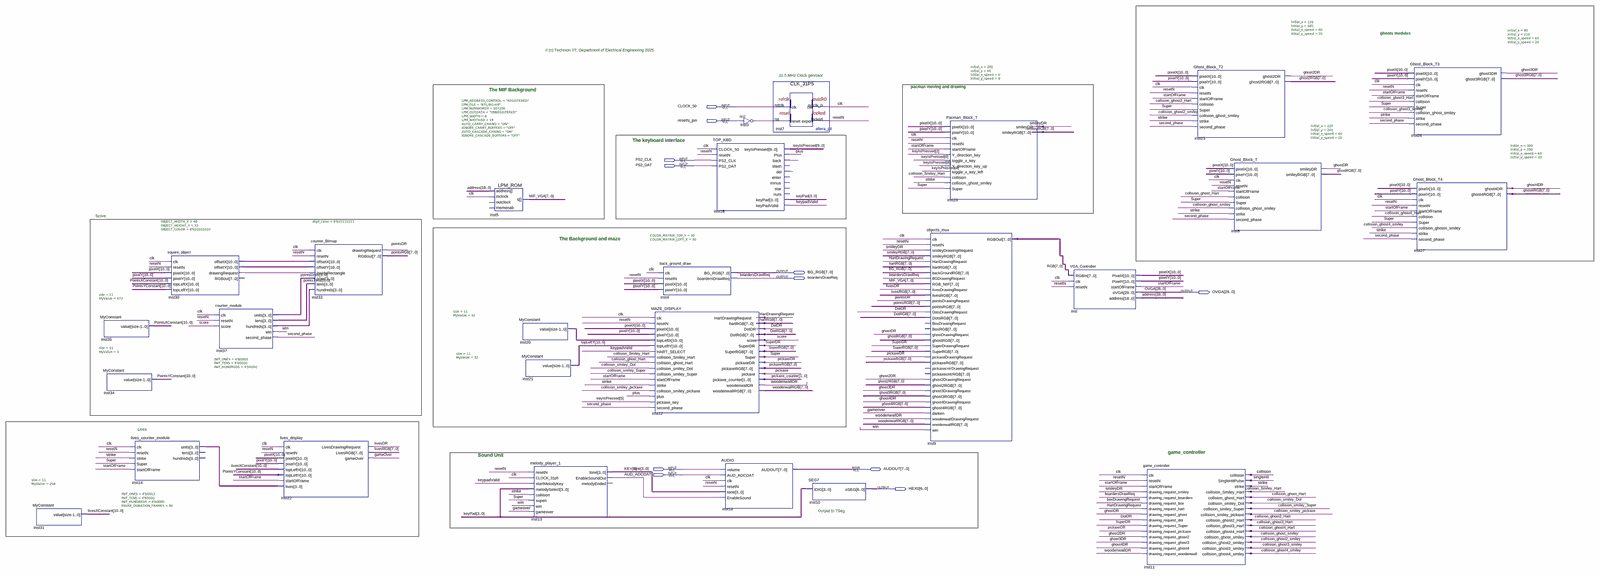
[diagram p0: schematic sheet, whole]
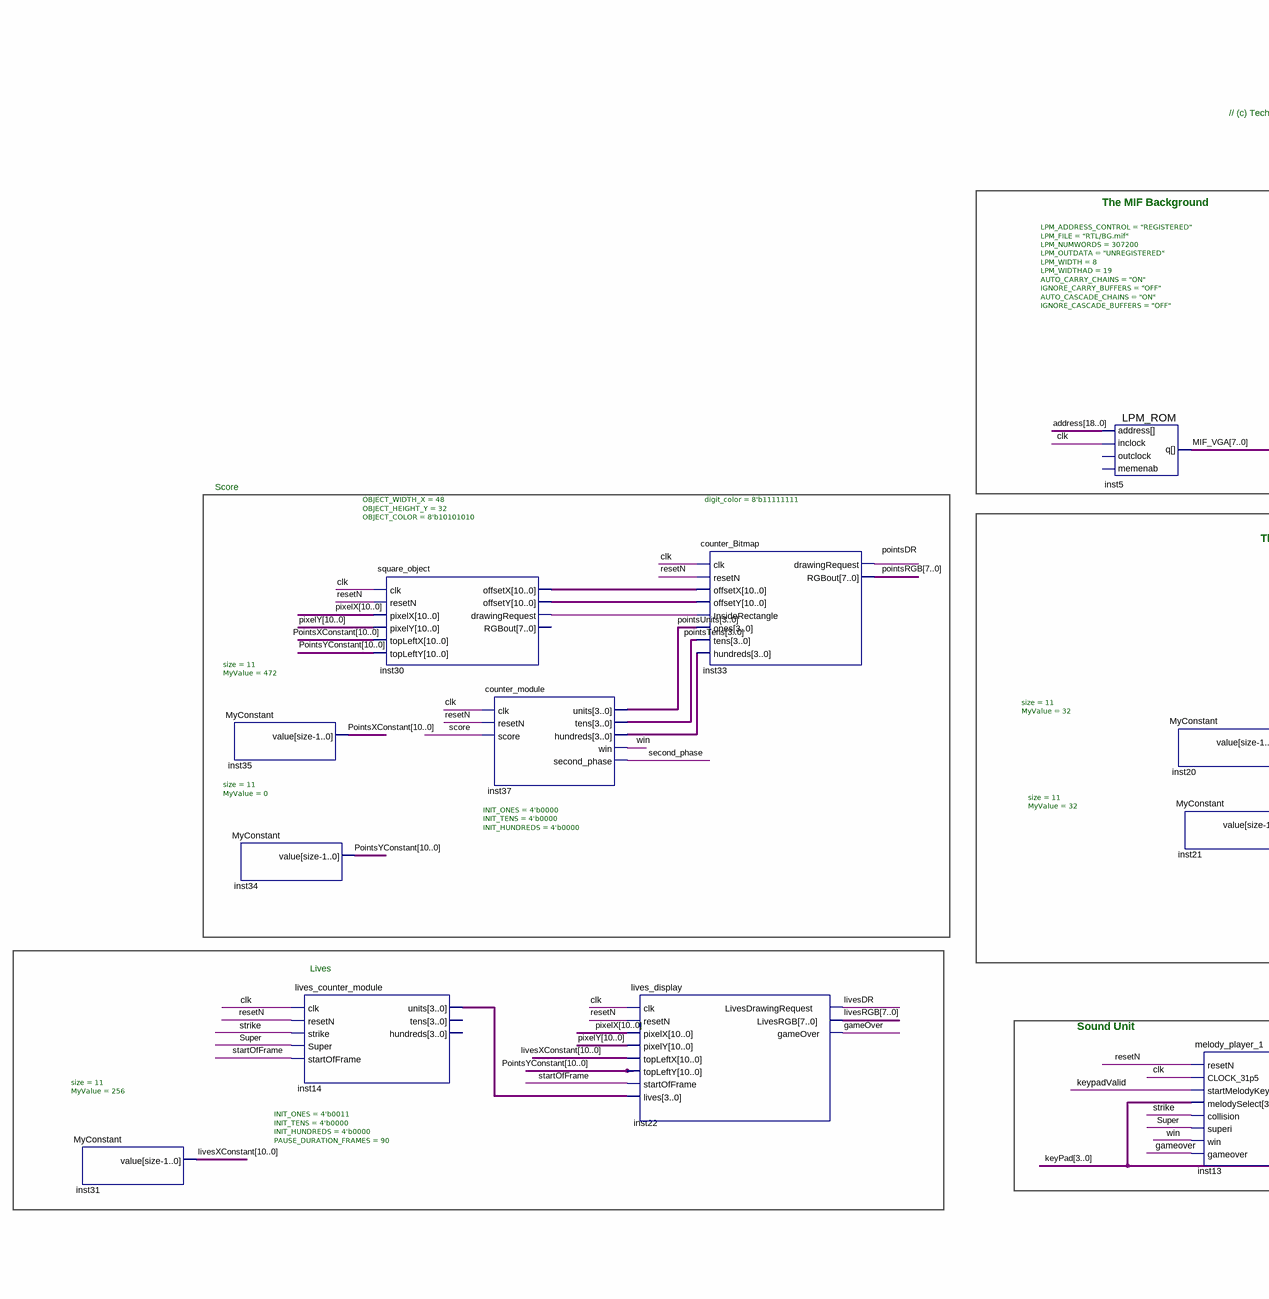
[diagram p1: schematic sheet, left part]
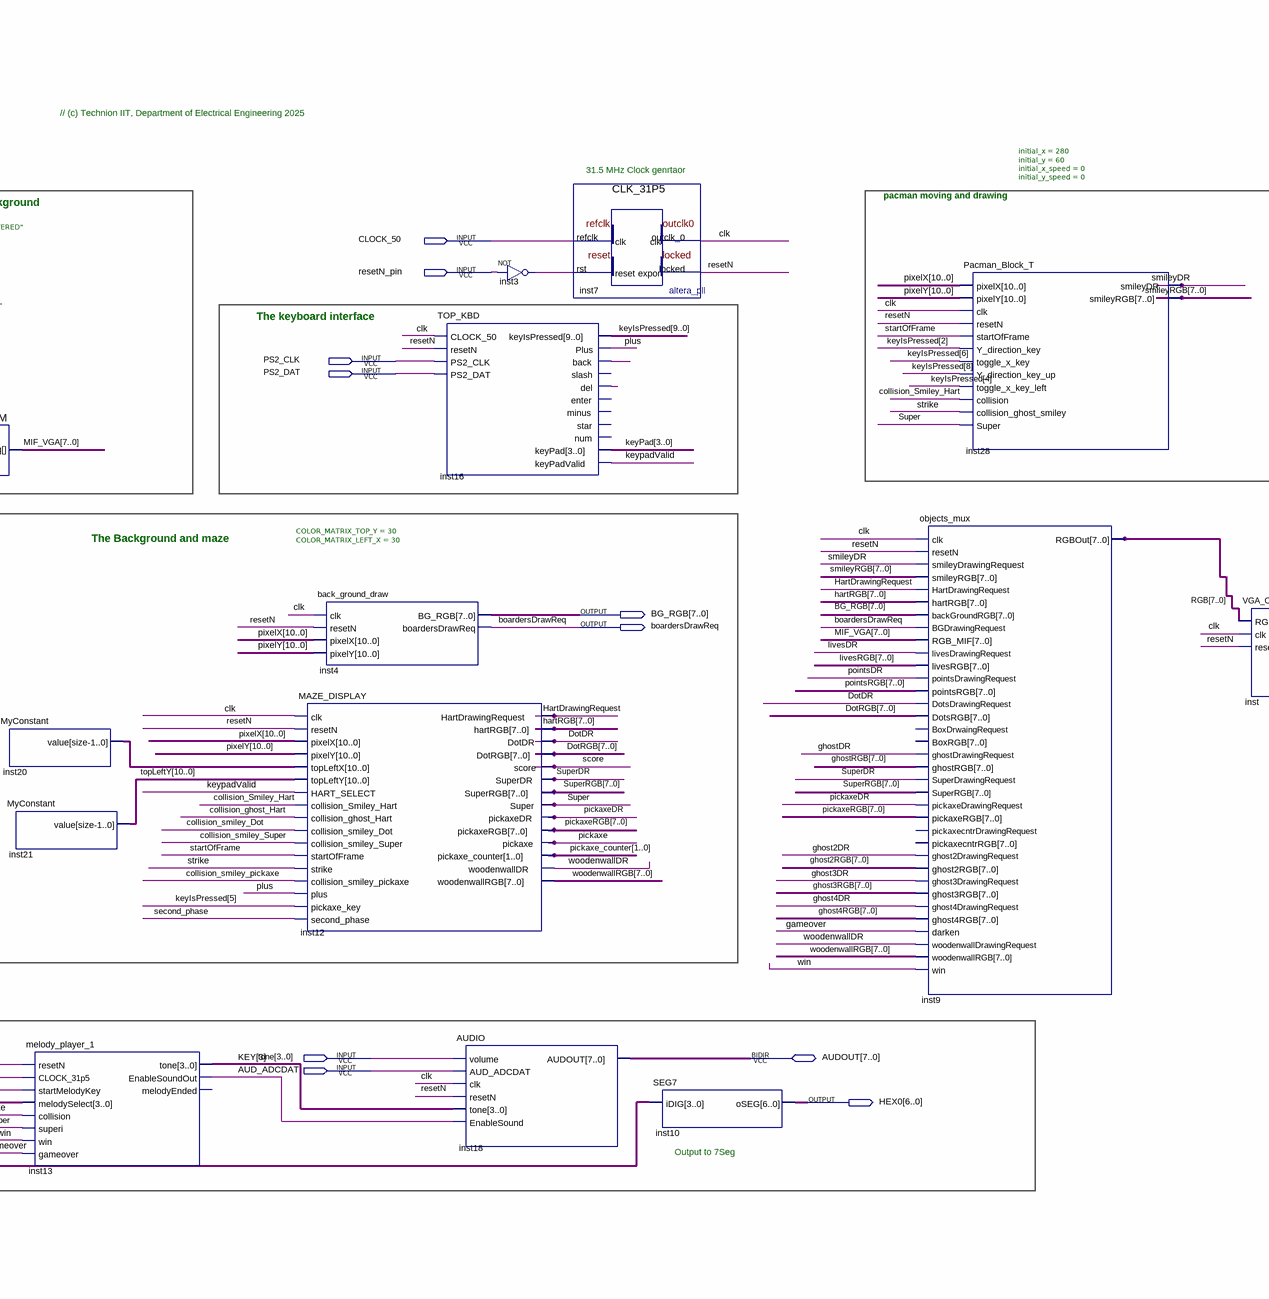
[diagram p2: schematic sheet, centre part]
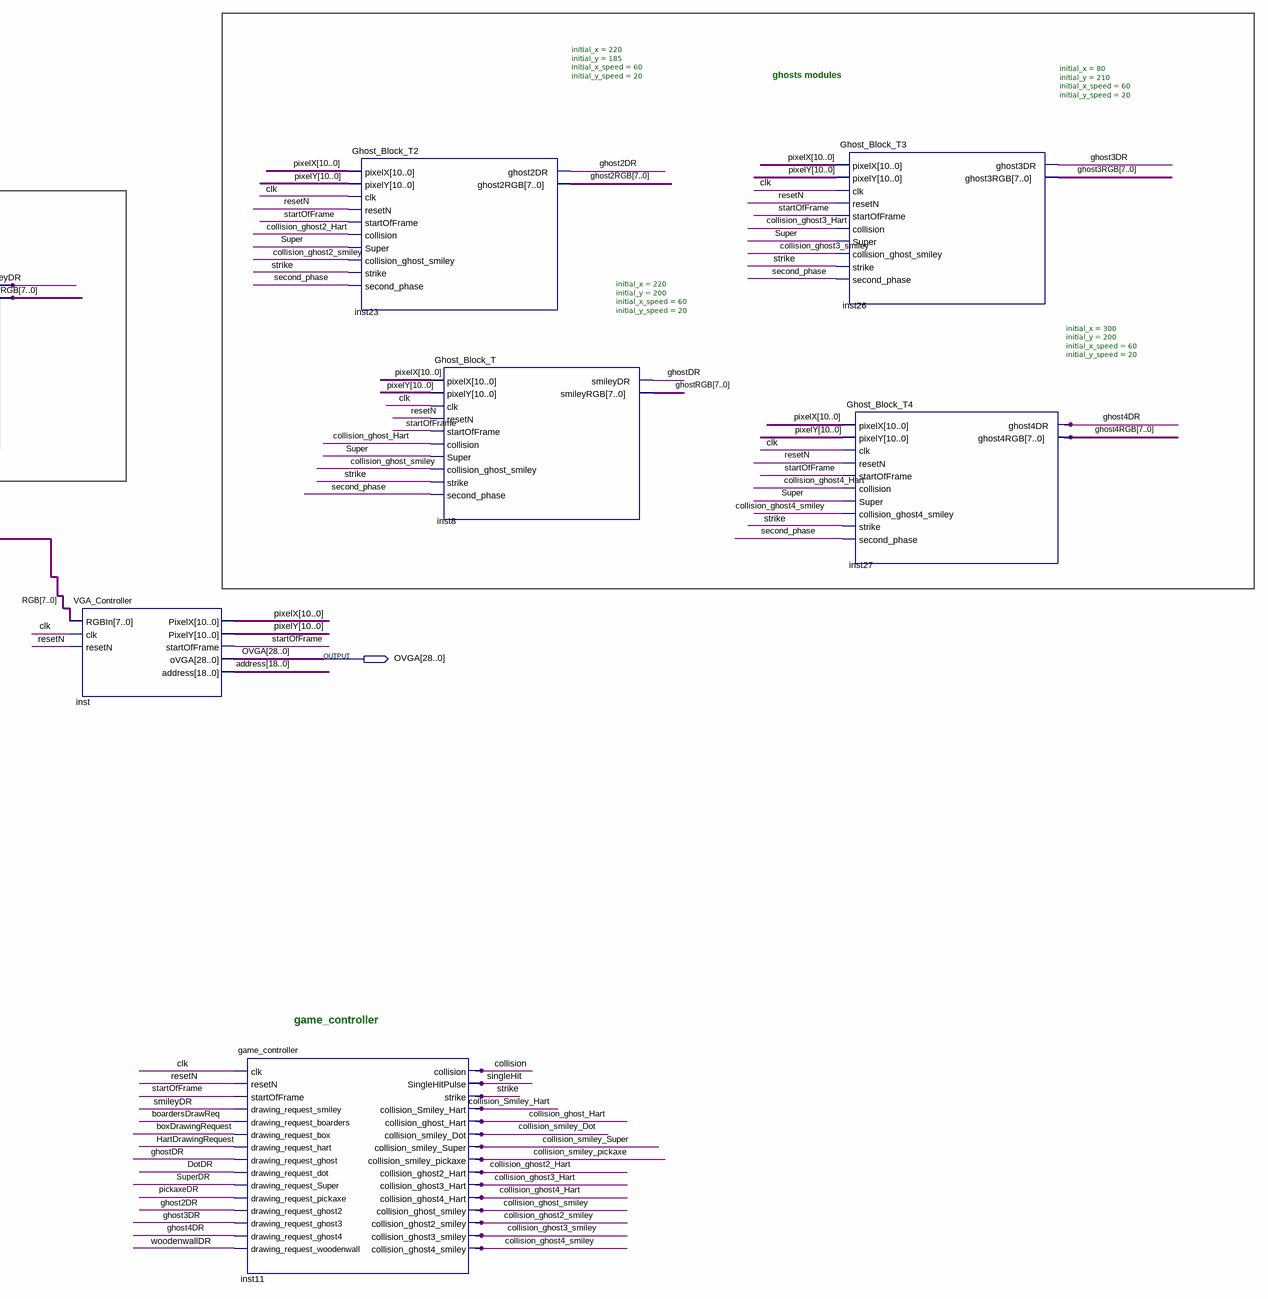
[diagram p3: schematic sheet, right part]
// Quartus schematic TOP_VGA_DEMO_KBD.bdf as structural Verilog: 27 symbols, 11 pins
module TOP_VGA_DEMO_KBD (
  input  CLOCK_50,
  input  resetN_pin,
  input  PS2_CLK,
  input  PS2_DAT,
  input  [3:3] KEY,
  input  AUD_ADCDAT,
  inout  [7:0] AUDOUT,
  output [7:0] BG_RGB,
  output boardersDrawReq,
  output [28:0] OVGA,
  output [6:0] HEX0
);

  wire boxDrawingRequest, clk, collision, collision_ghost2_Hart, collision_ghost2_smiley,
       collision_ghost3_Hart, collision_ghost3_smiley, collision_ghost4_Hart, collision_ghost4_smiley,
       collision_ghost_Hart, collision_ghost_smiley, collision_smiley_Dot, collision_Smiley_Hart,
       collision_smiley_pickaxe, collision_smiley_Super, DotDR, gameOver, ghost2DR, ghost3DR, ghost4DR,
       ghostDR, HartDrawingRequest, inst3_out, inst13_enablesoundout, inst16_back, inst16_del,
       inst30_drawingrequest, keypadValid, livesDR, pickaxe, pickaxeDR, plus, pointsDR, resetN, score,
       second_phase, singleHit, smileyDR, startOfFrame, strike, Super, SuperDR, win, woodenwallDR;
  wire [1:0] pickaxe_counter;
  wire [3:0] inst14_units, inst37_hundreds, keyPad, pointsTens, pointsUnits, tone;
  wire [7:0] DotRGB, ghost2RGB, ghost3RGB, ghost4RGB, ghostRGB, hartRGB, livesRGB, MIF_VGA, pickaxeRGB,
       pointsRGB, RGB, smileyRGB, SuperRGB, woodenwallRGB;
  wire [9:0] keyIsPressed;
  wire [10:0] inst20_value, inst30_offsetx, inst30_offsety, livesXConstant, pixelX, pixelY, PointsXConstant,
       PointsYConstant, topLeftY;
  wire [18:0] address;

  MyConstant #(.size(11), .MyValue(256)) inst31 (.value(livesXConstant));
  MyConstant #(.size(11), .MyValue(472)) inst35 (.value(PointsXConstant));
  MyConstant #(.size(11), .MyValue(0)) inst34 (.value(PointsYConstant));
  lives_counter_module #(.INIT_ONES(4'b0011), .INIT_TENS(4'b0000), .INIT_HUNDREDS(4'b0000), .PAUSE_DURATION_FRAMES(90)) inst14 (
    .clk(clk), .resetN(resetN), .strike(strike), .Super(Super), .startOfFrame(startOfFrame),
    .units(inst14_units));  // open: tens, hundreds
  square_object #(.OBJECT_WIDTH_X(48), .OBJECT_HEIGHT_Y(32), .OBJECT_COLOR(8'b10101010)) inst30 (
    .clk(clk), .resetN(resetN), .pixelX(pixelX), .pixelY(pixelY), .topLeftX(PointsXConstant),
    .topLeftY(PointsYConstant), .offsetX(inst30_offsetx), .offsetY(inst30_offsety),
    .drawingRequest(inst30_drawingrequest));  // open: RGBout
  counter_module #(.INIT_ONES(4'b0000), .INIT_TENS(4'b0000), .INIT_HUNDREDS(4'b0000)) inst37 (
    .clk(clk), .resetN(resetN), .score(score), .units(pointsUnits), .tens(pointsTens),
    .hundreds(inst37_hundreds), .win(win), .second_phase(second_phase));
  lives_display inst22 (
    .clk(clk), .resetN(resetN), .pixelX(pixelX), .pixelY(pixelY), .topLeftX(livesXConstant),
    .topLeftY(PointsYConstant), .startOfFrame(startOfFrame), .lives(inst14_units),
    .LivesDrawingRequest(livesDR), .LivesRGB(livesRGB), .gameOver(gameOver));
  counter_Bitmap #(.digit_color(8'b11111111)) inst33 (
    .clk(clk), .resetN(resetN), .offsetX(inst30_offsetx), .offsetY(inst30_offsety),
    .InsideRectangle(inst30_drawingrequest), .ones(pointsUnits), .tens(pointsTens),
    .hundreds(inst37_hundreds), .drawingRequest(pointsDR), .RGBout(pointsRGB));
  LPM_ROM #(.LPM_ADDRESS_CONTROL("REGISTERED"), .LPM_FILE("RTL/BG.mif"), .LPM_NUMWORDS(307200), .LPM_OUTDATA("UNREGISTERED"), .LPM_WIDTH(8), .LPM_WIDTHAD(19), .AUTO_CARRY_CHAINS("ON"), .IGNORE_CARRY_BUFFERS("OFF"), .AUTO_CASCADE_CHAINS("ON"), .IGNORE_CASCADE_BUFFERS("OFF")) inst5 (
    .address(address), .inclock(clk), .q(MIF_VGA));  // open: outclock, memenab
  MyConstant #(.size(11), .MyValue(32)) inst20 (.value(inst20_value));
  MyConstant #(.size(11), .MyValue(32)) inst21 (.value(topLeftY));
  melody_player_1 inst13 (
    .resetN(resetN), .CLOCK_31p5(clk), .startMelodyKey(keypadValid), .melodySelect(keyPad),
    .collision(strike), .superi(Super), .win(win), .gameover(gameOver), .tone(tone),
    .EnableSoundOut(inst13_enablesoundout));  // open: melodyEnded
  MAZE_DISPLAY inst12 (
    .clk(clk), .resetN(resetN), .pixelX(pixelX), .pixelY(pixelY), .topLeftX(inst20_value),
    .topLeftY(topLeftY), .HART_SELECT(keypadValid), .collision_Smiley_Hart(collision_Smiley_Hart),
    .collision_ghost_Hart(collision_ghost_Hart), .collision_smiley_Dot(collision_smiley_Dot),
    .collision_smiley_Super(collision_smiley_Super), .startOfFrame(startOfFrame), .strike(strike),
    .collision_smiley_pickaxe(collision_smiley_pickaxe), .plus(plus), .pickaxe_key(keyIsPressed[5]),
    .second_phase(second_phase), .HartDrawingRequest(HartDrawingRequest), .hartRGB(hartRGB), .DotDR(DotDR),
    .DotRGB(DotRGB), .score(score), .SuperDR(SuperDR), .SuperRGB(SuperRGB), .Super(Super),
    .pickaxeDR(pickaxeDR), .pickaxeRGB(pickaxeRGB), .pickaxe(pickaxe), .pickaxe_counter(pickaxe_counter),
    .woodenwallDR(woodenwallDR), .woodenwallRGB(woodenwallRGB));
  back_ground_draw #(.COLOR_MATRIX_TOP_Y(30), .COLOR_MATRIX_LEFT_X(30)) inst4 (
    .clk(clk), .resetN(resetN), .pixelX(pixelX), .pixelY(pixelY), .BG_RGB(BG_RGB),
    .boardersDrawReq(boardersDrawReq));
  TOP_KBD inst16 (
    .CLOCK_50(clk), .resetN(resetN), .PS2_CLK(PS2_CLK), .PS2_DAT(PS2_DAT), .keyIsPressed(keyIsPressed),
    .Plus(plus), .back(inst16_back), .del(inst16_del), .keyPad(keyPad), .keyPadValid(keypadValid));  // open: slash, enter, minus, star, num
  AUDIO inst18 (
    .volume(KEY[3]), .AUD_ADCDAT(AUD_ADCDAT), .clk(clk), .resetN(resetN), .tone(tone),
    .EnableSound(inst13_enablesoundout), .AUDOUT(AUDOUT));
  not inst3 (inst3_out, resetN_pin);
  CLK_31P5 inst7 (.refclk(CLOCK_50), .rst(inst3_out), .outclk_0(clk), .locked(resetN));
  SEG7 inst10 (.iDIG(keyPad), .oSEG(HEX0));
  objects_mux inst9 (
    .clk(clk), .resetN(resetN), .smileyDrawingRequest(smileyDR), .smileyRGB(smileyRGB),
    .HartDrawingRequest(HartDrawingRequest), .hartRGB(hartRGB), .backGroundRGB(BG_RGB),
    .BGDrawingRequest(boardersDrawReq), .RGB_MIF(MIF_VGA), .livesDrawingRequest(livesDR),
    .livesRGB(livesRGB), .pointsDrawingRequest(pointsDR), .pointsRGB(pointsRGB), .DotsDrawingRequest(DotDR),
    .DotsRGB(DotRGB), .ghostDrawingRequest(ghostDR), .ghostRGB(ghostRGB), .SuperDrawingRequest(SuperDR),
    .SuperRGB(SuperRGB), .pickaxeDrawingRequest(pickaxeDR), .pickaxeRGB(pickaxeRGB),
    .ghost2DrawingRequest(ghost2DR), .ghost2RGB(ghost2RGB), .ghost3DrawingRequest(ghost3DR),
    .ghost3RGB(ghost3RGB), .ghost4DrawingRequest(ghost4DR), .ghost4RGB(ghost4RGB), .darken(gameOver),
    .woodenwallDrawingRequest(woodenwallDR), .woodenwallRGB(woodenwallRGB), .win(win), .RGBOut(RGB));  // open: BoxDrwaingRequest, BoxRGB, pickaxecntrDrawingRequest, pickaxecntrRGB
  Pacman_Block_T #(.initial_x(280), .initial_y(60), .initial_x_speed(0), .initial_y_speed(0)) inst28 (
    .pixelX(pixelX), .pixelY(pixelY), .clk(clk), .resetN(resetN), .startOfFrame(startOfFrame),
    .Y_direction_key(keyIsPressed[2]), .toggle_x_key(keyIsPressed[6]), .Y_direction_key_up(keyIsPressed[8]),
    .toggle_x_key_left(keyIsPressed[4]), .collision(collision_Smiley_Hart), .collision_ghost_smiley(strike),
    .Super(Super), .smileyDR(smileyDR), .smileyRGB(smileyRGB));
  VGA_Controller inst (
    .RGBIn(RGB), .clk(clk), .resetN(resetN), .PixelX(pixelX), .PixelY(pixelY), .startOfFrame(startOfFrame),
    .oVGA(OVGA), .address(address));
  game_controller inst11 (
    .clk(clk), .resetN(resetN), .startOfFrame(startOfFrame), .drawing_request_smiley(smileyDR),
    .drawing_request_boarders(boardersDrawReq), .drawing_request_box(boxDrawingRequest),
    .drawing_request_hart(HartDrawingRequest), .drawing_request_ghost(ghostDR), .drawing_request_dot(DotDR),
    .drawing_request_Super(SuperDR), .drawing_request_pickaxe(pickaxeDR), .drawing_request_ghost2(ghost2DR),
    .drawing_request_ghost3(ghost3DR), .drawing_request_ghost4(ghost4DR),
    .drawing_request_woodenwall(woodenwallDR), .collision(collision), .SingleHitPulse(singleHit),
    .strike(strike), .collision_Smiley_Hart(collision_Smiley_Hart),
    .collision_ghost_Hart(collision_ghost_Hart), .collision_smiley_Dot(collision_smiley_Dot),
    .collision_smiley_Super(collision_smiley_Super), .collision_smiley_pickaxe(collision_smiley_pickaxe),
    .collision_ghost2_Hart(collision_ghost2_Hart), .collision_ghost3_Hart(collision_ghost3_Hart),
    .collision_ghost4_Hart(collision_ghost4_Hart), .collision_ghost_smiley(collision_ghost_smiley),
    .collision_ghost2_smiley(collision_ghost2_smiley), .collision_ghost3_smiley(collision_ghost3_smiley),
    .collision_ghost4_smiley(collision_ghost4_smiley));
  Ghost_Block_T2 #(.initial_x(220), .initial_y(185), .initial_x_speed(60), .initial_y_speed(20)) inst23 (
    .pixelX(pixelX), .pixelY(pixelY), .clk(clk), .resetN(resetN), .startOfFrame(startOfFrame),
    .collision(collision_ghost2_Hart), .Super(Super), .collision_ghost_smiley(collision_ghost2_smiley),
    .strike(strike), .second_phase(second_phase), .ghost2DR(ghost2DR), .ghost2RGB(ghost2RGB));
  Ghost_Block_T #(.initial_x(220), .initial_y(200), .initial_x_speed(60), .initial_y_speed(20)) inst8 (
    .pixelX(pixelX), .pixelY(pixelY), .clk(clk), .resetN(resetN), .startOfFrame(startOfFrame),
    .collision(collision_ghost_Hart), .Super(Super), .collision_ghost_smiley(collision_ghost_smiley),
    .strike(strike), .second_phase(second_phase), .smileyDR(ghostDR), .smileyRGB(ghostRGB));
  Ghost_Block_T3 #(.initial_x(80), .initial_y(210), .initial_x_speed(60), .initial_y_speed(20)) inst26 (
    .pixelX(pixelX), .pixelY(pixelY), .clk(clk), .resetN(resetN), .startOfFrame(startOfFrame),
    .collision(collision_ghost3_Hart), .Super(Super), .collision_ghost_smiley(collision_ghost3_smiley),
    .strike(strike), .second_phase(second_phase), .ghost3DR(ghost3DR), .ghost3RGB(ghost3RGB));
  Ghost_Block_T4 #(.initial_x(300), .initial_y(200), .initial_x_speed(60), .initial_y_speed(20)) inst27 (
    .pixelX(pixelX), .pixelY(pixelY), .clk(clk), .resetN(resetN), .startOfFrame(startOfFrame),
    .collision(collision_ghost4_Hart), .Super(Super), .collision_ghost4_smiley(collision_ghost4_smiley),
    .strike(strike), .second_phase(second_phase), .ghost4DR(ghost4DR), .ghost4RGB(ghost4RGB));

  // Notes on the sheet:
  //   ghosts modules
  //   // (c) Technion IIT, Department of Electrical Engineering 2025
  //   31.5 MHz Clock genrtaor
  //   pacman moving and drawing
  //   The MIF Background
  //   The keyboard interface
  //   Score
  //   The Background and maze
  //   Lives
  //    game_controller
  //   Sound Unit
  //   Output to 7Seg
endmodule
